# EasyEDA schematic OCC Test-MCP6002.json
TITLE: Sheet_1; REV: 1.0; Date: 2026-03-19; Sheet: 1/1; Drawn By: helmut-f; Company: Your Company
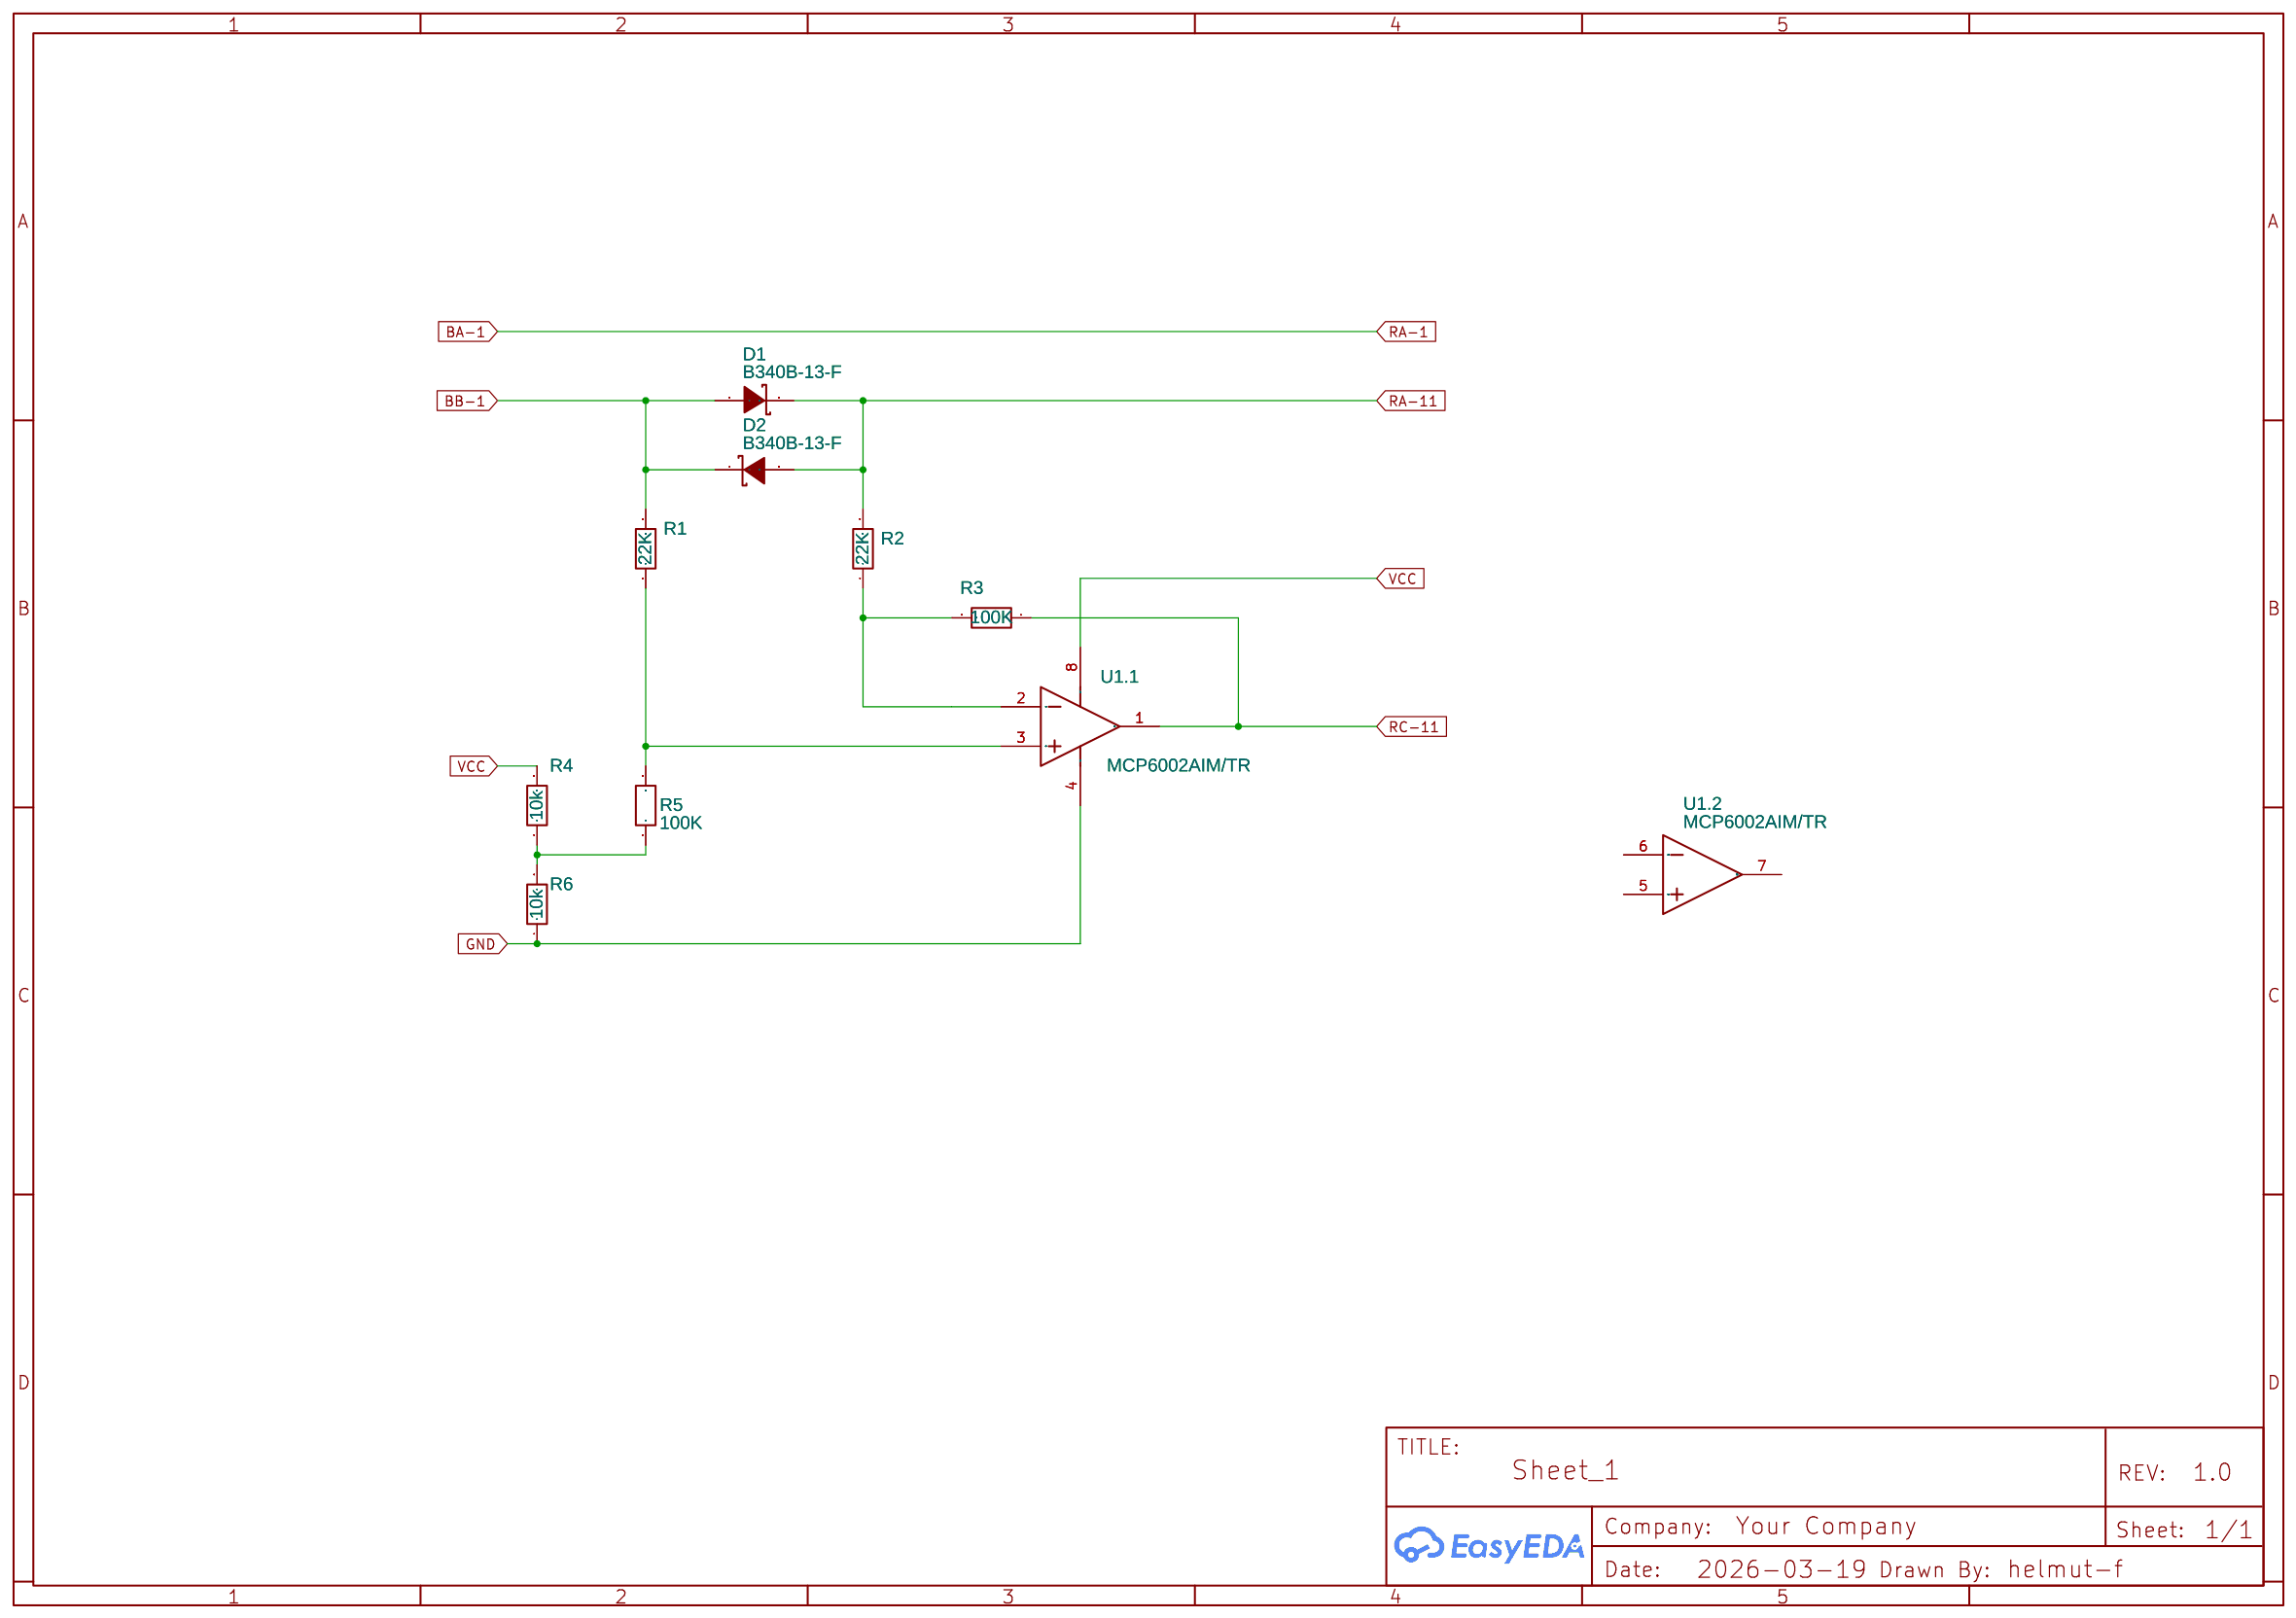
[diagram p0: schematic sheet]

## Parts
D1  B340B-13-F  [SMB_L4.6-W3.6-LS5.3-RD]
D2  B340B-13-F  [SMB_L4.6-W3.6-LS5.3-RD]
R1  22K  [R1206]
R2  22K  [R1206]
R3  100K  [R1206]
R4  10k  [R1206]
R5  100K  [R1206]
R6  10k  [R1206]
U1  MCP6002AIM/TR  [SOP-8_L4.9-W3.9-P1.27-LS6.0-BL]  (sections 1,2)

## Library data of the parts
D1 D2 = B340B-13-F: Supplier: LCSC; Manufacturer: DIODES(美台); Supplier Part: C85099; JLCPCB Part Class: Extended Part
R1-R6 = R_1206_EU: Contributor: LCEDA_Lib
U1 = MCP6002AIM/TR: Supplier: LCSC; Supplier Part: C50314587; Manufacturer: HGSEMI(华冠); subpart_no: 1; JLCPCB Part Class: Extended Part

## Nets
GND: R6.1 U1.4(-VS)
VCC: R4.2 U1.8(+VS)
BB-1: D1.2(A) D2.1(K) R1.2
RA-11: D1.1(K) D2.2(A) R2.2
RC-11: R3.1 U1.1(OUTA)
Net-(R1-1): R1.1 R5.2 U1.3(+INA)
Net-(R2-1): R2.1 R3.2 U1.2(-INA)
Net-(R4-1): R4.1 R5.1 R6.2

Not connected (* = marked no-connect by the designer): U1 5(+INB) 6(-INB) 7(OUTB)
